# EasyEDA schematic AERA Erdubatterie.json
TITLE: Sheet_1; REV: 1.0; Date: 2021-10-04; Sheet: 1/1; Drawn By: KDruschel; Company: Your Company
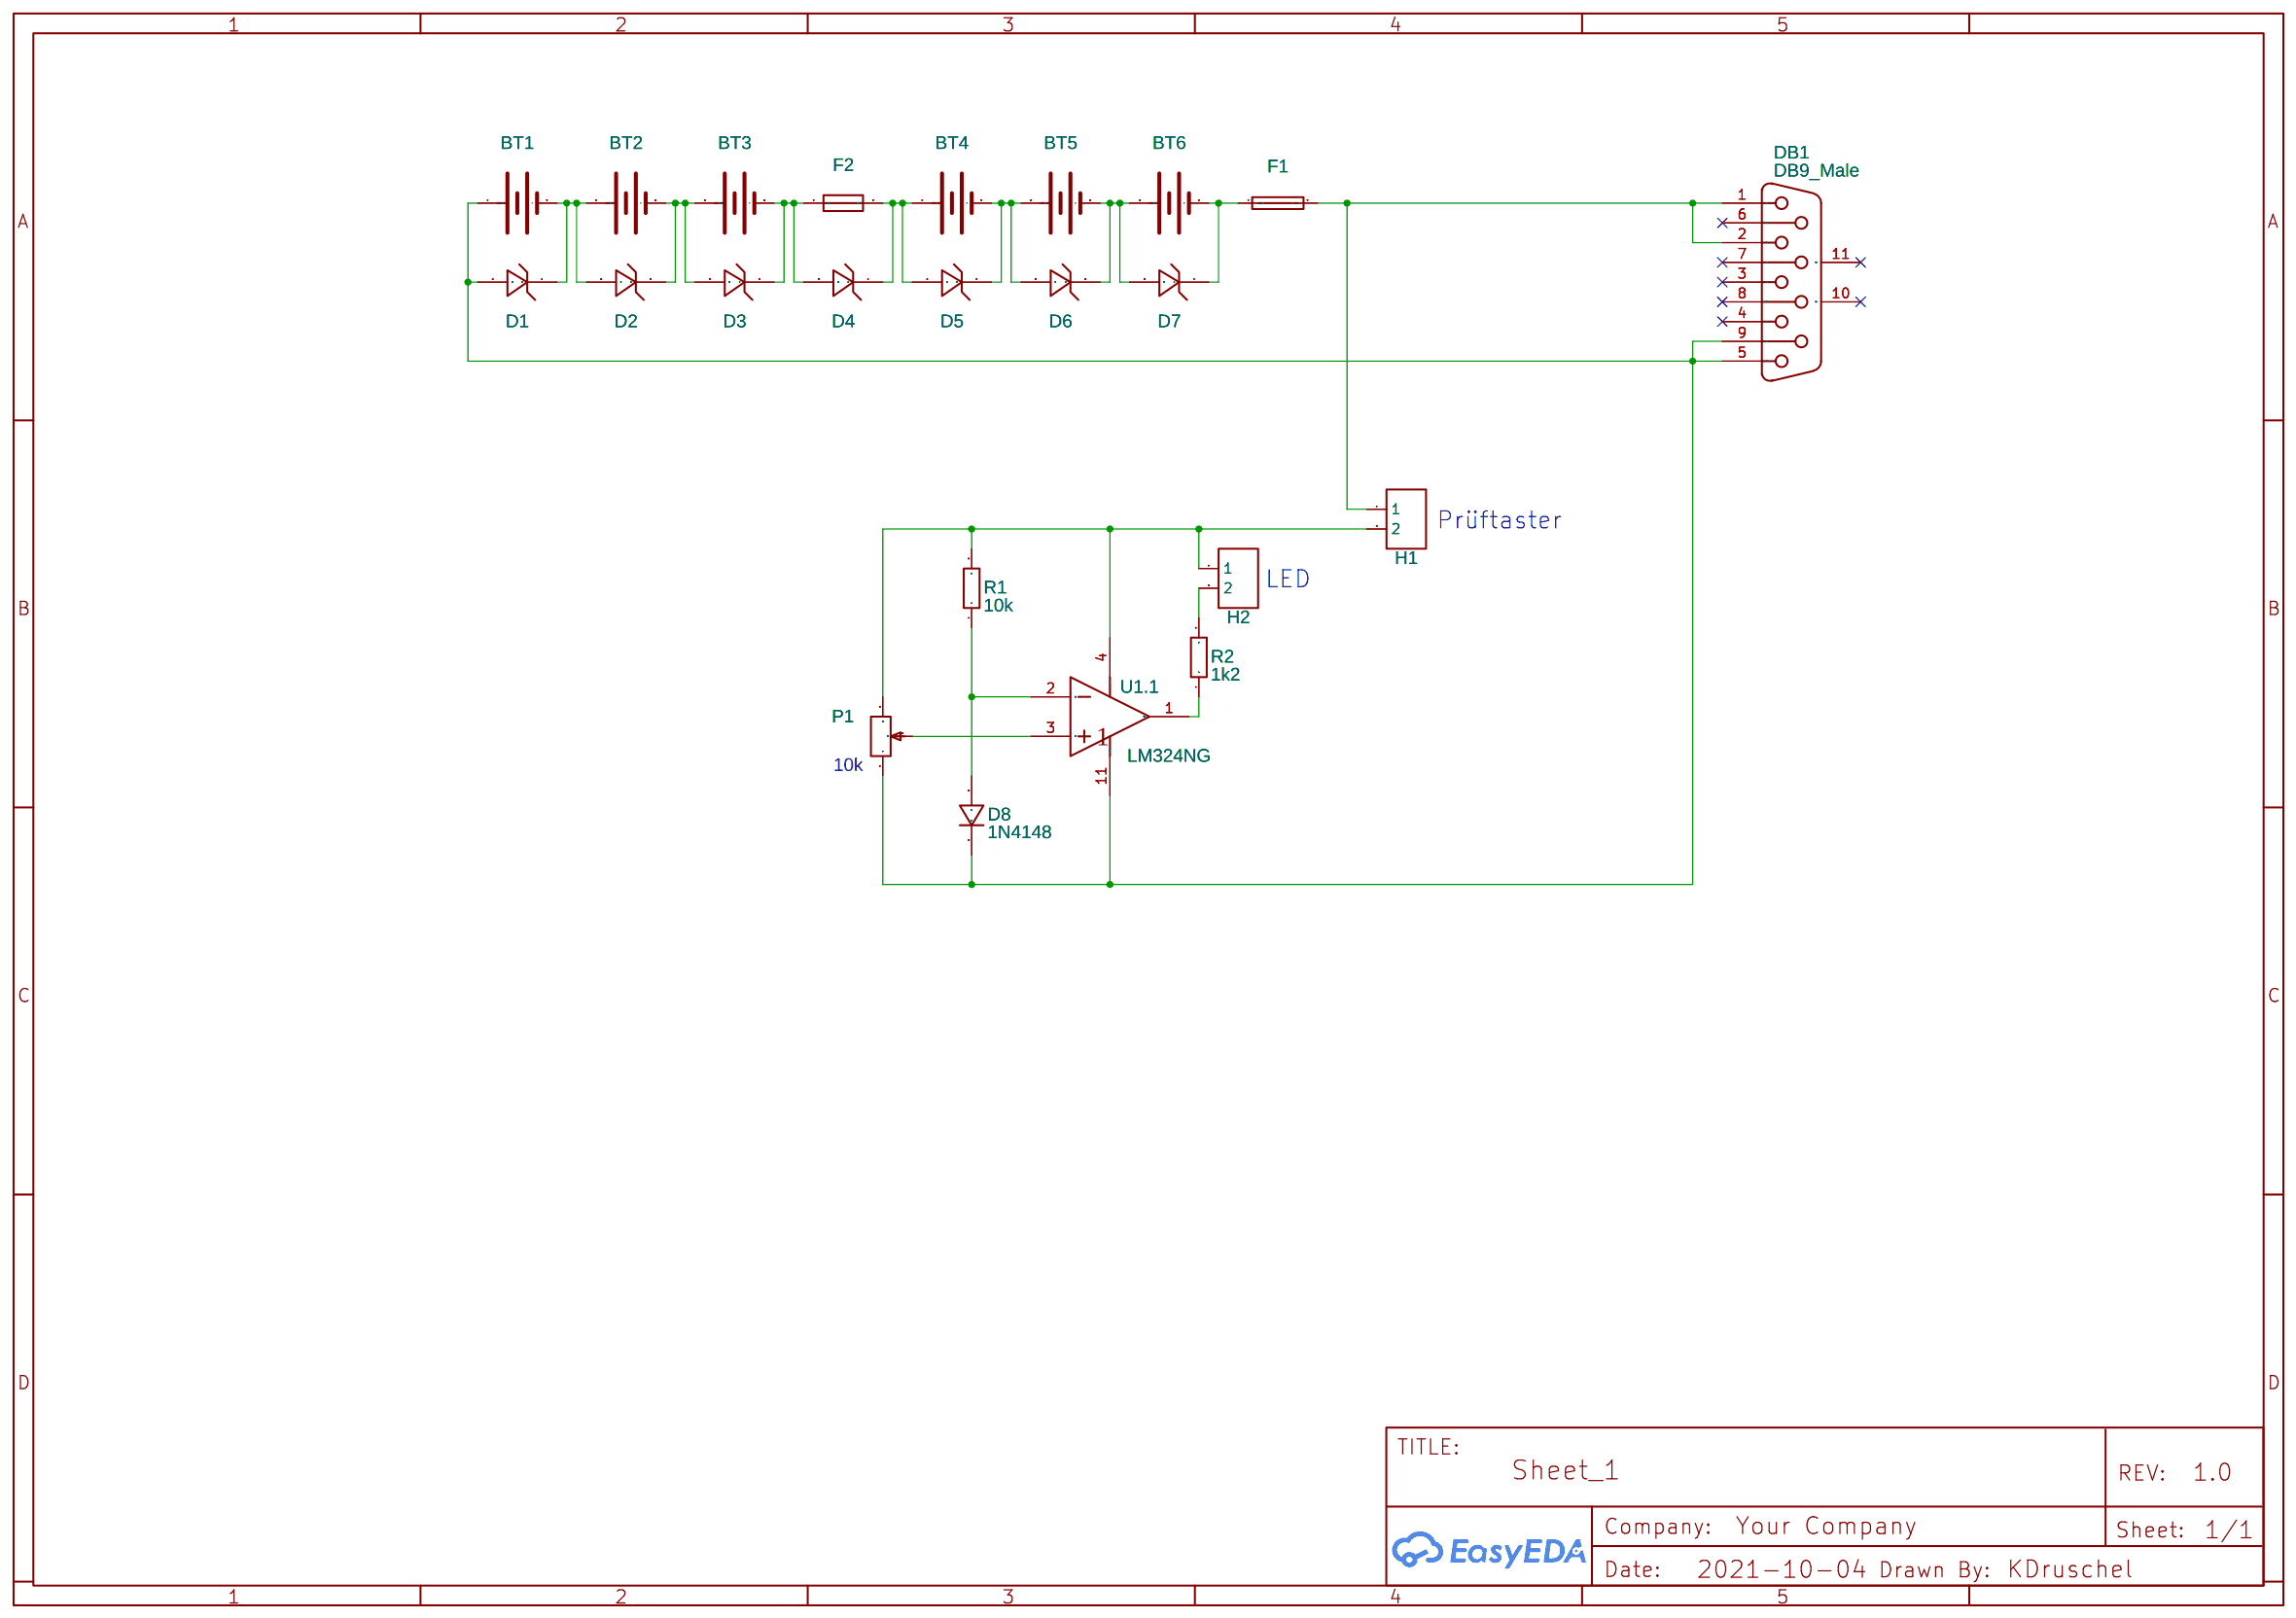
[diagram p0: schematic sheet]

## Parts
BT1  1025  [BAT-TH_KEYSTONE-1025]
BT2  1025  [BAT-TH_KEYSTONE-1025]
BT3  1025  [BAT-TH_KEYSTONE-1025]
BT4  1025  [BAT-TH_KEYSTONE-1025]
BT5  1025  [BAT-TH_KEYSTONE-1025]
BT6  1025  [BAT-TH_KEYSTONE-1025]
D1  RS1JL R3G  [SUB-SMA_L2.8-W1.8-LS3.6-RD]
D2  RS1JL R3G  [SUB-SMA_L2.8-W1.8-LS3.6-RD]
D3  RS1JL R3G  [SUB-SMA_L2.8-W1.8-LS3.6-RD]
D4  RS1JL R3G  [SUB-SMA_L2.8-W1.8-LS3.6-RD]
D5  RS1JL R3G  [SUB-SMA_L2.8-W1.8-LS3.6-RD]
D6  RS1JL R3G  [SUB-SMA_L2.8-W1.8-LS3.6-RD]
D7  RS1JL R3G  [SUB-SMA_L2.8-W1.8-LS3.6-RD]
D8  1N4148  [DO-35_BD2.0-L4.2-P8.20-D0.5-RD]
DB1  DB9_Male  [DSUB-TH_DMR-9P]
F1  250V 5A Slow break  [FUSE-SMD_5-20MM]
F2  0216.250MXP  [FUSE-SMD_L20.0-W5.0]
H1  HDR-F-2.54_1x2  [HDR-F-2.54_1X2]
H2  HDR-F-2.54_1x2  [HDR-F-2.54_1X2]
P1  Precision potentiometer 3296W/50ohm  [RES-ADJ-TH_3296W]
R1  10k  [RES-TH_BD7.0-L18.0-P22.00-D0.5]
R2  1k2  [RES-TH_BD7.0-L18.0-P22.00-D0.5]
U1  LM324NG  [PDIP-14_L19.7-W6.6-P2.54-LS8.3-BL]  (section 1)

## Library data of the parts
BT1-BT6 = 1025: Supplier: LCSC; Supplier Part: C238060; Manufacturer: Keystone; Contributor: LCSC; JLCPCB Part Class: Extended Part
D1-D7 = RS1JL R3G: Supplier: LCSC; Supplier Part: C483946; Manufacturer: Taiwan Semiconductor(Taiwan Semicon); Contributor: LCSC; JLCPCB Part Class: Extended Part
D8 = 1N4148_C13769: Supplier: LCSC; Supplier Part: C13769; Manufacturer: STMicroelectronics; Contributor: LCSC
DB1 = DB9_Male: Supplier Part: C185657; Supplier: LCSC; Manufacturer: Amphenol; Contributor: LCEDA_Lib
F1 = 250V 5A Slow break: Supplier: LCSC; Manufacturer: XCFuse; Supplier Part: C38454; JLCPCB Part Class: Extended Part
F2 = 0216.250MXP: Supplier: LCSC; Supplier Part: C178846; Manufacturer: Littelfuse; Contributor: LCSC
H1 H2 = HDR-F-2.54_1x2: Supplier Part: C49661; Supplier: LCSC; Contributor: LCEDA_Lib
P1 = Precision potentiometer 3296W/50ohm: Supplier Part: C21881; Supplier: LCSC; Manufacturer: ReliaPro
R1 R2 = MFR03SF1000A10_C58754: Supplier: LCSC; Manufacturer: UniOhm; Manufacturer Part: MFR03SF1000A10; Supplier Part: C58754
U1 = LM324NG: Supplier Part: C99121; Supplier: LCSC; Manufacturer Part: ON; subpart_no: 1

## Nets
Net-(BT1-1): BT1.1(+) D1.2 D8.1 DB1.5 DB1.9 P1.1 U1.11(GND)
Net-(BT1-2): BT1.2(-) BT2.1(+) D1.1 D2.2
Net-(BT2-2): BT2.2(-) BT3.1(+) D2.1 D3.2
Net-(BT3-2): BT3.2(-) D3.1 D4.2 F2.1
Net-(BT4-1): BT4.1(+) D4.1 D5.2 F2.2
Net-(BT4-2): BT4.2(-) BT5.1(+) D5.1 D6.2
Net-(BT5-2): BT5.2(-) BT6.1(+) D6.1 D7.2
Net-(BT6-2): BT6.2(-) D7.1 F1.1
Net-(D8-2): D8.2 R1.1 U1.2(IN1-)
Net-(DB1-1): DB1.1 DB1.2 F1.2 H1.1
Net-(H1-2): H1.2 H2.1 P1.3 R1.2 U1.4(VCC)
Net-(H2-2): H2.2 R2.2
Net-(P1-2): P1.2 U1.3(IN1+)
Net-(R2-1): R2.1 U1.1(OUT1)

Not connected (* = marked no-connect by the designer): DB1 3* 4* 6* 7* 8* 10(MH1)* 11(MH2)*

## Notes on the sheet
- Prüftaster
- LED
- 10k
